# EAGLE design EasyADC (EAGLE 6.1)
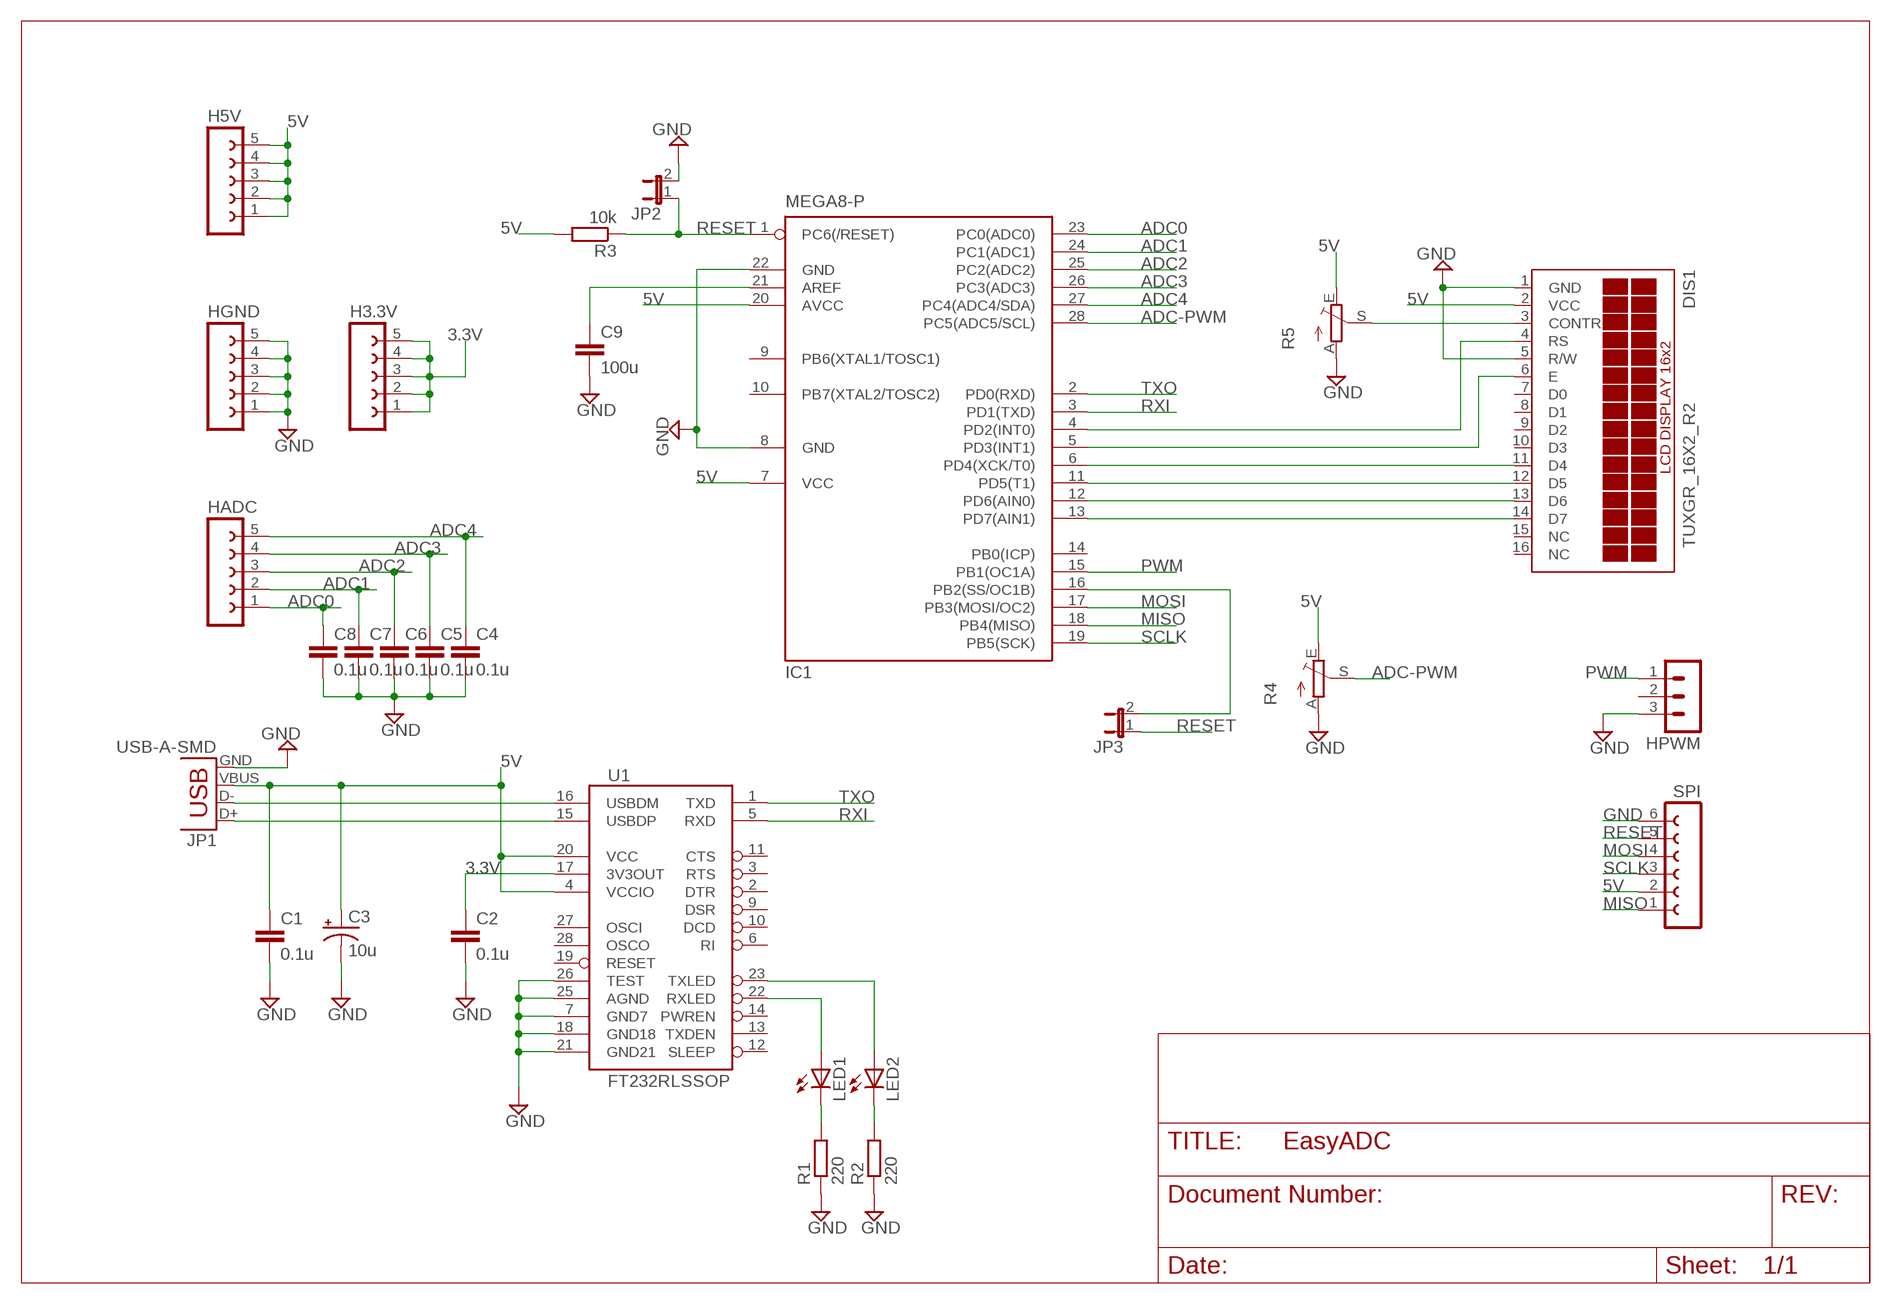
[diagram p0: schematic, sheet 1]

## Parts
C1  0.1u  C-EU050-045X075  [C050-045X075]
C2  0.1u  C-EU050-045X075  [C050-045X075]
C3  10u  CAP_POLPTH2  [CPOL-RADIAL-10UF-25V]
C4  0.1u  C-EU050-045X075  [C050-045X075]
C5  0.1u  C-EU050-045X075  [C050-045X075]
C6  0.1u  C-EU050-045X075  [C050-045X075]
C7  0.1u  C-EU050-045X075  [C050-045X075]
C8  0.1u  C-EU050-045X075  [C050-045X075]
C9  100u  C-EU050-075X075  [C050-075X075]
DIS1  TUXGR_16X2_R2  [TUXGR_16X2_R2]
H3.3V  FE05-1  [FE05-1]
H5V  FE05-1  [FE05-1]
HADC  FE05-1  [FE05-1]
HGND  FE05-1  [FE05-1]
HPWM  MA03-1  [MA03-1]
IC1  MEGA8-P  [DIL28-3]
JP1  USB-A-SMD  [USB-A-S-NOSILK-FEMALE]
JP2  JUMPER-2PTH  [1X02]
JP3  JUMPER-2PTH  [1X02]
LED1  LED3MM  [LED3MM]
LED2  LED3MM  [LED3MM]
R1  220  R-EU_0207/10  [0207/10]
R2  220  R-EU_0207/10  [0207/10]
R3  10k  R-EU_0207/10  [0207/10]
R4  TRIM_EU-CA6H  [CA6H]
R5  TRIM_EU-CA6H  [CA6H]
SPI  FE06-1  [FE06]
U1  FT232RLSSOP  [SSOP28DB]

## Nets
3.3V: C2.1 H3.3V.1 H3.3V.2 H3.3V.3 H3.3V.4 H3.3V.5 U1.17(3V3OUT)
5V: C1.1 C3.1(+) DIS1.2(VCC) H5V.1 H5V.2 H5V.3 H5V.4 H5V.5 IC1.7(VCC) IC1.20(AVCC) JP1.VBUS R3.2 R4.E R5.E SPI.2 U1.4(VCCIO) U1.20(VCC)
ADC0: C8.1 HADC.1 IC1.23(PC0(ADC0))
ADC1: C7.1 HADC.2 IC1.24(PC1(ADC1))
ADC2: C6.1 HADC.3 IC1.25(PC2(ADC2))
ADC3: C5.1 HADC.4 IC1.26(PC3(ADC3))
ADC4: C4.1 HADC.5 IC1.27(PC4(ADC4/SDA))
ADC-PWM: IC1.28(PC5(ADC5/SCL)) R4.S
GND: C1.2 C2.2 C3.2(-) C4.2 C5.2 C6.2 C7.2 C8.2 C9.2 DIS1.1(GND) DIS1.5(R/W) HGND.1 HGND.2 HGND.3 HGND.4 HGND.5 HPWM.3 IC1.8(GND) IC1.22(GND) JP1.GND JP2.2 R1.1 R2.1 R4.A R5.A SPI.6 U1.7(GND7) U1.18(GND18) U1.21(GND21) U1.25(AGND) U1.26(TEST)
MISO: IC1.18(PB4(MISO)) SPI.1
MOSI: IC1.17(PB3(MOSI/OC2)) SPI.4
N$1: LED1.A U1.22(RXLED)
N$2: JP1.D- U1.16(USBDM)
N$3: JP1.D+ U1.15(USBDP)
N$4: LED2.A U1.23(TXLED)
N$5: LED1.K(C) R1.2
N$6: LED2.K(C) R2.2
N$7: DIS1.14(D7) IC1.13(PD7(AIN1))
N$8: DIS1.13(D6) IC1.12(PD6(AIN0))
N$9: DIS1.12(D5) IC1.11(PD5(T1))
N$10: DIS1.11(D4) IC1.6(PD4(XCK/T0))
N$11: DIS1.4(RS) IC1.4(PD2(INT0))
N$12: DIS1.6(E) IC1.5(PD3(INT1))
N$13: DIS1.3(CONTR) R5.S
N$14: C9.1 IC1.21(AREF)
N$15: IC1.16(PB2(SS/OC1B)) JP3.2
PWM: HPWM.1 IC1.15(PB1(OC1A))
RESET: IC1.1(PC6(/RESET)) JP2.1 JP3.1 R3.1 SPI.5
RXI: IC1.3(PD1(TXD)) U1.5(RXD)
SCLK: IC1.19(PB5(SCK)) SPI.3
TXO: IC1.2(PD0(RXD)) U1.1(TXD)
Unconnected: DIS1.7(D0) DIS1.8(D1) DIS1.9(D2) DIS1.10(D3) DIS1.15(NC) DIS1.16(NC) HPWM.2 IC1.9(PB6(XTAL1/TOSC1)) IC1.10(PB7(XTAL2/TOSC2)) IC1.14(PB0(ICP)) U1.2(DTR) U1.3(RTS) U1.6(RI) U1.9(DSR) U1.10(DCD) U1.11(CTS) U1.12(SLEEP) U1.13(TXDEN) U1.14(PWREN) U1.19(RESET) U1.27(OSCI) U1.28(OSCO)

## Library data of the parts
C1 C2 C4-C9 = rcl:C-EU: CAPACITOR, European symbol
C3 = SparkFun-Capacitors:CAP_POL: Capacitor Polarized These are standard SMD and PTH capacitors. Normally 10uF, 47uF, and 100uF in electrolytic and tantalum varieties. Always verify the external diameter of the through hole cap, it varies with capacity, voltage, and manufacturer. The EIA devices should be standard.
DIS1 = display-lcd:TUXGR_16X2_R2: Tuxgraphics LCD display 16x2 characters reflective, without background light Source: tuxgr_12x2_r2.pdf; OC_FARNELL: unknown; OC_NEWARK: unknown
H3.3V H5V HADC HGND = con-lsta:FE05-1: FEMALE HEADER; OC_FARNELL: unknown; OC_NEWARK: unknown
HPWM = con-lstb:MA03-1: PIN HEADER; OC_FARNELL: unknown; OC_NEWARK: unknown
IC1 = atmel:MEGA8-P: MICROCONTROLLER 8 Kbytes FLASH, 1 kbytes SRAM, 512 bytes EEPROM, USART, 4-channel 10 bit ADC, 2-channel 8 bit ADC Pin compatible with Atmega48, ATMega88, ATMega168 Source: avr.lbr; OC_FARNELL: unknown; OC_NEWARK: unknown
JP1 = SparkFun-Connectors:USB: USB Connectors USB-B-PTH is fully proven SKU : PRT-00139/CONN-08278 USB-miniB is fully proven SKU : PRT-00587 USB-A-PCB is untested. USB-A-H is throughly reviewed, but untested. Spark Fun Electronics SKU : PRT-00437 USB-B-SMT is throughly reviewed, but untested. Needs silkscreen touching up. USB-A-S has not been used/tested USB-MB-H has not been used/tested USB-MICROB has been used. CONN-09505; PROD_ID: CONN-09520
JP2 JP3 = SparkFun-Retired:JUMPER-2: Jumper Basic 0.1" spaced jumper. Use with breakaway headers.
LED1 LED2 = led:LED: LED OSRAM: - CHIPLED LG R971, LG N971, LY N971, LG Q971, LY Q971, LO R971, LY R971 LH N974, LH R974 LS Q976, LO Q976, LY Q976 LO Q996 - Hyper CHIPLED LW Q18S LB Q993, LB Q99A, LB R99A - SideLED LS A670, LO A670, LY A670, LG A670, LP A670 LB A673, LV A673, LT A673, LW A673 LH A674 LY A675 LS A676, LA A676, LO A676, LY A676, LW A676 LS A679, LY A679, LG A679 - Hyper Micro SIDELED® LS Y876, LA Y876, LO Y876, LY Y876 LT Y87S - SmartLED LW L88C, LW L88S LB L89C, LB L89S, LG L890 LS L89K, LO L89K, LY L89K LS L896, LA L896, LO L896, LY L896 - TOPLED LS T670, LO T670, LY T670, LG T670, LP T670 LSG T670, LSP T670, LSY T670, LOP T670, LYG T670 LG T671, LOG T671, LSG T671 LB T673, LV T673, LT T673, LW T673 LH T674 LS T676, LA T676, LO T676, LY T676, LB T676, LH T676, LSB T676, LW T676 LB T67C, LV T67C, LT T67C, LS T67K, LO T67K, LY T67K, LW E67C LS E67B, LA E67B, LO E67B, LY E67B, LB E67C, LV E67C, LT E67C LW T67C LS T679, LY T679, LG T679 LS T770, LO T770, LY T770, LG T770, LP T770 LB T773, LV T773, LT T773, LW T773 LH T774 LS E675, LA E675, LY E675, LS T675 LS T776, LA T776, LO T776, LY T776, LB T776 LHGB T686 LT T68C, LB T68C - Hyper Mini TOPLED® LB M676 - Mini TOPLED Santana® LG M470 LS M47K, LO M47K, LY M47K Source: http://www.osram.convergy.de LUXEON: - LUMILED® LXK2-PW12-R00, LXK2-PW12-S00, LXK2-PW14-U00, LXK2-PW14-V00 LXK2-PM12-R00, LXK2-PM12-S00, LXK2-PM14-U00 LXK2-PE12-Q00, LXK2-PE12-R00, LXK2-PE12-S00, LXK2-PE14-T00, LXK2-PE14-U00 LXK2-PB12-K00, LXK2-PB12-L00, LXK2-PB12-M00, LXK2-PB14-N00, LXK2-PB14-P00, LXK2-PB14-Q00 LXK2-PR12-L00, LXK2-PR12-M00, LXK2-PR14-Q00, LXK2-PR14-R00 LXK2-PD12-Q00, LXK2-PD12-R00, LXK2-PD12-S00 LXK2-PH12-R00, LXK2-PH12-S00 LXK2-PL12-P00, LXK2-PL12-Q00, LXK2-PL12-R00 Source: www.luxeon.com KINGBRIGHT: KA-3528ASYC Source: www.kingbright.com
R1-R3 = rcl:R-EU_: RESISTOR, European symbol
R4 R5 = pot:TRIM_EU-: POTENTIOMETER
SPI = con-lsta:FE06-1: FEMALE HEADER; OC_FARNELL: unknown; OC_NEWARK: unknown
U1 = SparkFun-DigitalIC:FT232RL: USB UART FT232RL 4th Generation USB UART (USB <-> Serial) Controller. Spark Fun Electronics SKU : COM-00650 Production SKU IC-00870; PROD_ID: IC-00870

## Board
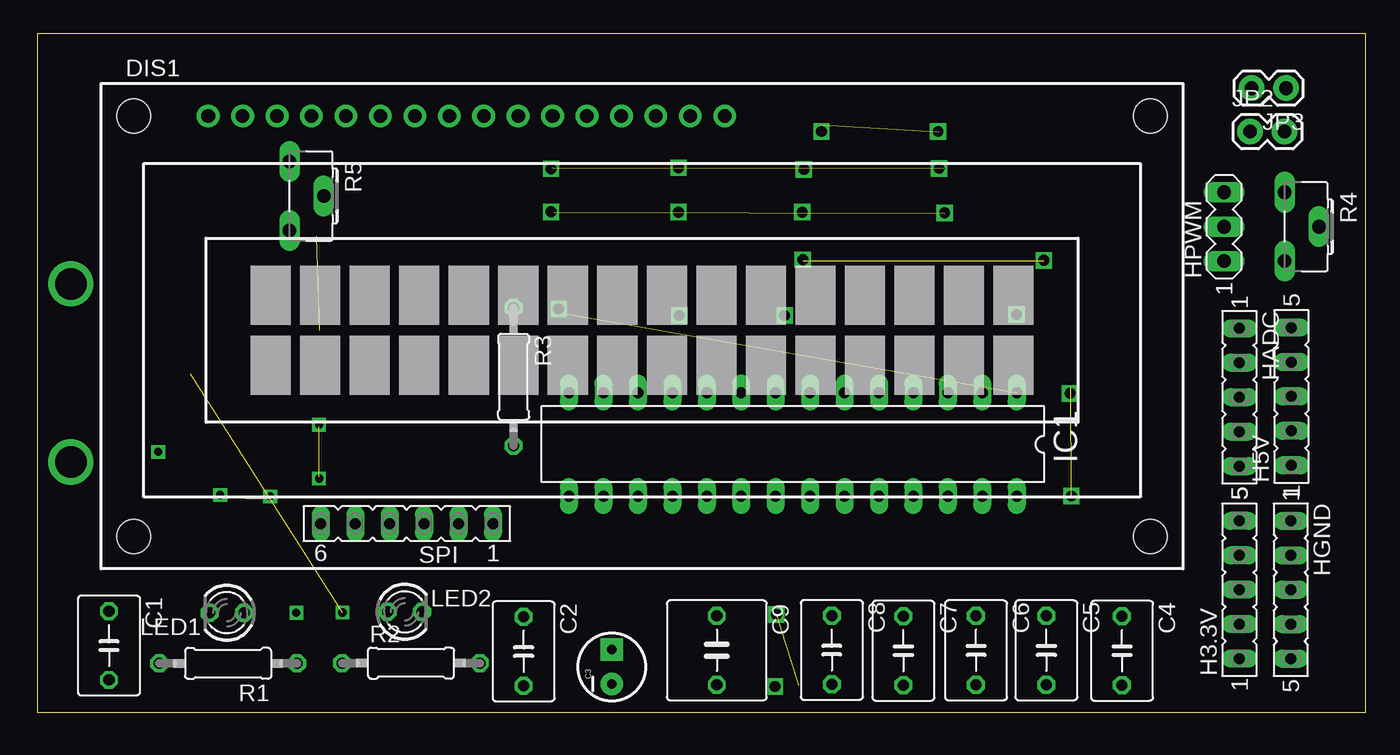
[diagram p1: board, top side]
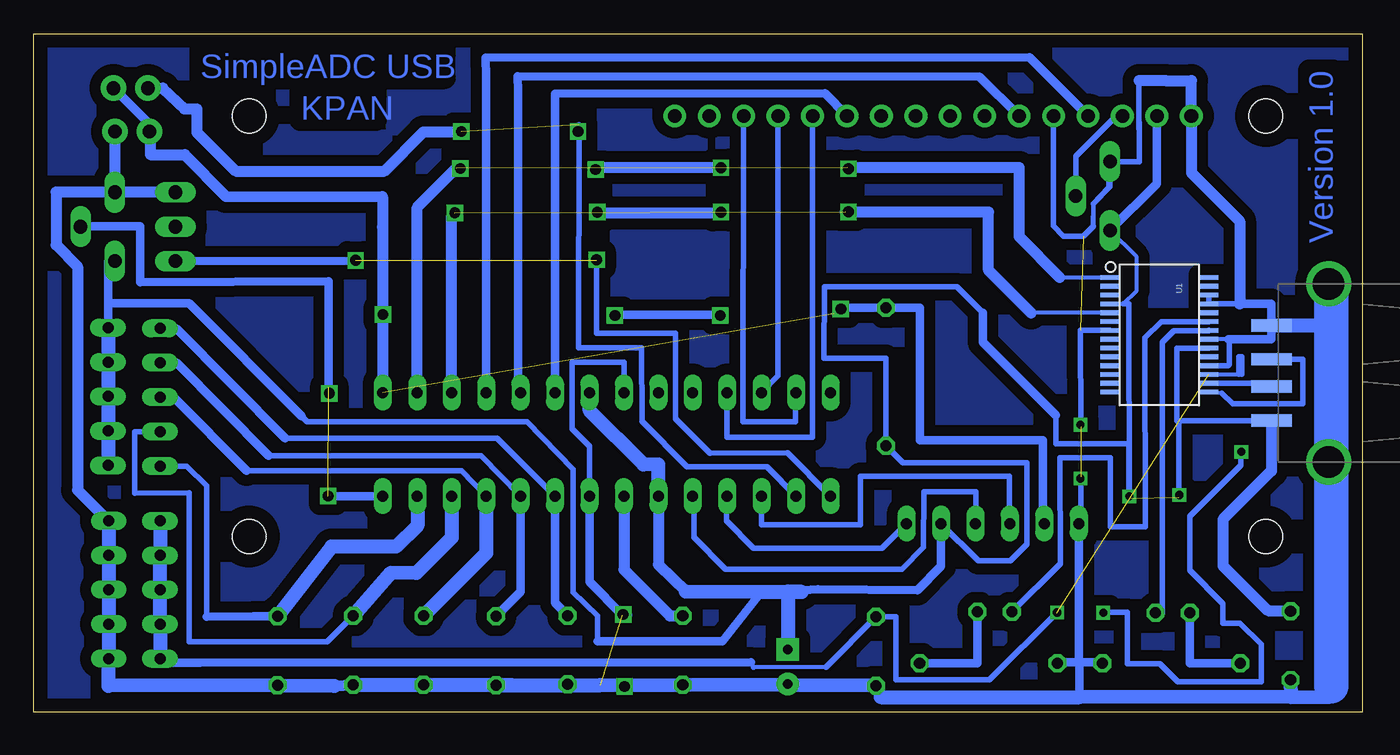
[diagram p2: board, bottom side, seen from below]

Size 98 x 50 mm. Coordinates in mm from the lower left corner, seen from the top.
Outline: 0,0 98,0 98,50 0,50 0,0
Copper layers (1*16): Top 0.035mm / dielectric 1.5mm / Bottom 0.035mm
Design rules: minimum track width 10mil, minimum drill 24mil, track to track 8mil, track to pad 8mil, pad to pad 8mil, via to via 8mil, smd to smd 8mil, copper to edge 40mil, drill to drill 8mil, minimum pad ring 10mil, minimum via ring 8mil, stop-mask expansion 4mil, vias tented up to drill 0mil, thermal gap 10mil

### Footprints (pad centres in the part's own frame; a part is rotated, then mirrored left to right if it is on the bottom)
C050-045X075 = drill 0.813 octagon: 1 -2.54,0; 2 2.54,0
CPOL-RADIAL-10UF-25V = drill 0.7 pad 1.651 square: 1 1.27,0 | drill 0.7 pad 1.651: 2 -1.27,0
C050-075X075 = drill 0.813 octagon: 1 -2.54,0; 2 2.54,0
TUXGR_16X2_R2 = drill 1 pad 1.676: 1 -32,15.5; 2 -29.46,15.5; 3 -26.92,15.5; 4 -24.38,15.5; 5 -21.84,15.5; 6 -19.3,15.5; 7 -16.76,15.5; 8 -14.22,15.5; 9 -11.68,15.5; 10 -9.14,15.5; 11 -6.6,15.5; 12 -4.06,15.5; 13 -1.52,15.5; 14 1.02,15.5; 15 3.56,15.5; 16 6.1,15.5 | hole 2.5: -37.5,-15.5; 37.5,-15.5; -37.5,15.5; 37.5,15.5
FE05-1 = drill 0.813 long: 1 -5.08,0; 2 -2.54,0; 3 0,0; 4 2.54,0; 5 5.08,0
MA03-1 = drill 1.016 long: 1 -2.54,0; 2 0,0; 3 2.54,0
DIL28-3 = drill 0.813 long: 1 -16.51,-3.81; 2 -13.97,-3.81; 3 -11.43,-3.81; 4 -8.89,-3.81; 5 -6.35,-3.81; 6 -3.81,-3.81; 7 -1.27,-3.81; 8 1.27,-3.81; 9 3.81,-3.81; 10 6.35,-3.81; 11 8.89,-3.81; 12 11.43,-3.81; 13 13.97,-3.81; 14 16.51,-3.81; 15 16.51,3.81; 16 13.97,3.81; 17 11.43,3.81; 18 8.89,3.81; 19 6.35,3.81; 20 3.81,3.81; 21 1.27,3.81; 22 -1.27,3.81; 23 -3.81,3.81; 24 -6.35,3.81; 25 -8.89,3.81; 26 -11.43,3.81; 27 -13.97,3.81; 28 -16.51,3.81
USB-A-S-NOSILK-FEMALE = smd 3 x 0.9: D+ 4.212,-1; D- 4.212,1; GND 4.212,-3.5; VBUS 4.212,3.5 | drill 2.311: S1 0,-6.566; S2 0,6.566
1X02 = drill 1.016 pad 1.88: 1 0,0; 2 2.54,0
LED3MM = drill 0.813 octagon: A -1.27,0; K 1.27,0
0207/10 = drill 0.813 octagon: 1 -5.08,0; 2 5.08,0
CA6H = drill 1.016 long: A -2.54,0; E 2.54,0; S 0,2.54
FE06 = drill 0.813 long: 1 -6.35,0; 2 -3.81,0; 3 -1.27,0; 4 1.27,0; 5 3.81,0; 6 6.35,0
SSOP28DB = smd 0.348 x 1.397: 1 -4.225,-3.656; 2 -3.575,-3.656; 3 -2.925,-3.656; 4 -2.275,-3.656; 5 -1.625,-3.656; 6 -0.975,-3.656; 7 -0.325,-3.656; 8 0.325,-3.656; 9 0.975,-3.656; 10 1.625,-3.656; 11 2.275,-3.656; 12 2.925,-3.656; 13 3.575,-3.656; 14 4.225,-3.656; 15 4.225,3.656; 16 3.575,3.656; 17 2.925,3.656; 18 2.275,3.656; 19 1.625,3.656; 20 0.975,3.656; 21 0.325,3.656; 22 -0.325,3.656; 23 -0.975,3.656; 24 -1.625,3.656; 25 -2.275,3.656; 26 -2.925,3.656; 27 -3.575,3.656; 28 -4.225,3.656

### Placement (x,y rotation side)
C1  5.31,4.9 270 top
C2  35.89,4.47 270 top
C3  42.39,3.33 90 top
C4  80.04,4.52 270 top
C5  74.45,4.55 270 top
C6  69.27,4.55 270 top
C7  63.91,4.52 270 top
C8  58.62,4.57 270 top
C9  50.14,4.55 270 top
DIS1  44.63,28.45 0 top
H3.3V  88.7,9.02 90 top
H5V  92.53,23.27 90 top
HADC  88.7,23.22 270 top
HGND  92.48,9.02 270 top
HPWM  87.55,35.79 90 top
IC1  55.75,19.74 180 top
JP1  2.5,25 180 bottom
JP2  89.48,42.8 0 top
JP3  92.13,46 180 top
LED1  14,7.32 180 top
LED2  27.13,7.39 0 top
R1  14.1,3.58 180 top
R2  27.58,3.61 0 top
R3  35.15,24.71 270 top
R4  92.02,35.79 270 top
R5  18.62,38.05 270 top
SPI  27.28,13.89 180 top
U1  14.99,27.81 270 bottom

### Tracks (layer width: path | path; a pad name or v marks a point on that pad's centre or on a via)
3.3V  (1 unrouted)
  Bottom 0.305: 39.57,3.3 44.93,3.3
  Bottom 0.406: 44.93,3.3 45.11,3.66 | 39.57,3.3 C2.1 34.42,7.01 34.42,2.36 27.51,2.36 22.56,7.32
  Bottom 0.61: 45.11,3.66 85.73,3.63 88.65,3.63 H3.3V.1
  Bottom 1.016: H3.3V.5 H3.3V.4 H3.3V.3 H3.3V.2 H3.3V.1
5V  (1 unrouted)
  Bottom 0.305: U1.4 17.64,30.09 16.66,31.06 16.66,33.55 R5.E
  Bottom 0.406: SPI.2 28.35,11.15 25.96,11.15 24.74,12.37 24.74,18.36 33.88,18.36 R3.2 35.15,26.09 39.73,26.09 39.67,31.37 29.92,31.37 29.16,30.58 28.02,29.44 | U1.20 13.69,26.84 13.69,21.46 13.56,21.46 | 13.56,21.46 6.71,21.46 JP1.VBUS | 17.64,30.09 17.25,30.09 17.2,15.72 17.22,15.72 17.22,19.79 22.63,19.79 22.63,21.89 | 13.56,21.46 13.56,15.8 | H5V.3 92.51,23.27 92.51,30.12 | 78.26,21.82 77.85,21.39 61.62,21.39 58.24,17.91 58.24,8.84 56.44,7.09 56.44,5.23
  Bottom 0.61: SPI.2 31.09,10.74 32.84,8.99 40.16,9.04 42.39,8.89 | R4.E 92.53,33.25 H5V.5 | DIS1.2 15.17,38.96 R5.E | 92.51,30.12 86.56,30.12 78.26,21.82 | 56.44,5.23 47.22,5.23 44.32,8.87 | 22.63,21.89 27.99,27.28 28.02,29.44
  Bottom 0.813: IC1.20 51.94,10.87 49.91,8.89 | JP1.VBUS 6.71,17.77 10.29,14.2 10.29,10.77 6.99,7.47 5.33,7.47 C1.1
  Bottom 1.016: H5V.5 H5V.4 H5V.3 H5V.2 H5V.1 | IC1.20 51.94,18.24 53.04,18.26 57,22.23 IC1.7 | 49.91,8.89 44.32,8.87 41.35,8.87 42.39,8.89 C3.1
ADC0
  Bottom 0.406: HADC.1 87.45,28.25 | 79.45,20.19 63.83,20.19 IC1.23
  Bottom 0.61: 87.45,28.25 79.45,20.19 | IC1.23 59.56,8.05 C8.1
ADC1
  Bottom 0.406: IC1.24 65,18.9 80.7,18.9 | 87.48,25.76 HADC.2
  Bottom 0.61: 80.7,18.9 87.48,25.76 | IC1.24 62.1,8.87 C7.1
ADC2
  Bottom 0.406: HADC.3 87.71,23.22 | 82.3,17.78 66.45,17.78 IC1.25
  Bottom 0.61: 87.71,23.22 82.3,17.78
  Bottom 1.016: IC1.25 64.64,11.71 C6.1
ADC3
  Bottom 0.406: HADC.4 90.58,20.68 90.58,16.13 86.54,16.18 86.54,5.18 76.35,5.18 C5.1
  Bottom 1.016: IC1.26 67.18,12.85 69.8,10.24 71.68,10.26 C5.1
ADC4
  Bottom 0.406: HADC.5 86.72,18.14 85.24,16.69 85.27,7.01
  Bottom 0.61: 85.27,7.01 81.79,7.06 C4.1
  Bottom 1.016: IC1.27 69.7,13.74 71.3,12.19 76.05,12.19 C4.1
ADC-PWM  (via drill 0.8)  (1 unrouted)
  Bottom 0.406: R4.S 94.54,35.79
  Bottom 0.61: 76.25,23.95 76.25,31.75 90.14,31.67 90.14,35.81 94.56,35.81 R4.S | IC1.28 v76.3,15.93
GND  (3 unrouted)
  Bottom 0.305: U1.21 9.88,27.49 | 19.86,35.81 19.86,37.49 19.89,35.79
  Bottom 0.406: IC1.8 54.46,25.78 58.32,25.78 58.32,20.9 57.02,19.61 IC1.22 | 22.63,3.66 R2.1 | U1.26 U1.25 9.07,30.09 | 19.86,35.81 19.89,35.79 20.6,35.08 22.05,35.08 22.81,35.84 22.81,43.93 DIS1.5 | U1.18 9.92,25.54 9.83,25.63 9.83,27.44 9.88,27.49 | 12.62,46.56 12.62,43.97 | SPI.6 20.78,13.89 20.78,17.35 | U1.7 20.83,28.14 20.78,21.03 | 16.48,46.56 16.46,40.59 R5.A 18.62,38.73 19.86,37.49 18.69,38.71 18.69,40.56 16.46,40.62 16.48,45.21 16.48,46.56
  Bottom 0.61: IC1.22 57.02,9.6 54.58,7.14 | 9.88,27.49 6.71,27.49 JP1.GND 6.71,30.09 9.07,30.09 | 20.88,3.66 22.63,3.66 | 20.88,1.12 20.88,3.66 | 20.88,3.66 19.08,3.66 R1.1 | SPI.6 20.93,3.58 20.88,3.66 | 12.63,46.56 14.53,46.56
  Bottom 0.813: 75.82,1.93 C5.2 | 62.79,2.01 C7.2 | 56.21,1.98 C8.2 | 54.58,7.14 54.28,7.14 | 35.53,1.09 35.61,1.32 C2.2 41.35,1.93 C3.2 | HPWM.3 R4.A | JP2.2 R4.A | R4.A 96.37,38.33 96.37,34.44 94.77,32.84 94.77,16.36 92.48,14.07 | DIS1.1 12.63,46.56 | 16.48,46.56 14.53,46.56 12.62,46.56 | 12.62,43.97 12.62,39.75 9.07,36.2 9.07,30.09
  Bottom 1.016: 75.82,1.93 C4.2 92.48,1.93 HGND.5 HGND.4 HGND.3 HGND.2 92.48,14.07 HGND.1 | C5.2 C6.2 62.79,2.01 | C7.2 56.21,1.98 C9.2 C2.2 | 35.53,1.09 20.88,1.09 20.88,1.12 5.28,1.09 | C1.2 5.28,1.09 | 5.28,1.09 2.51,1.12 | JP1.GND 2.51,28.5 arc-90 2.49,28.52
MISO
  Bottom 0.406: SPI.1 35.43,12.09 44.91,12.09 46.91,14.1 IC1.18
MOSI
  Bottom 0.406: SPI.4 26.06,15.19 26.04,17.37 37.03,17.37 37.03,13.82 44.32,13.82 IC1.17
N$1
  Bottom 0.406: LED1.A 14.76,7.29 14.76,27.28 13.92,28.12 11.35,28.12 U1.22
N$2
  Bottom 0.305: 7.37,24.02 7.59,24.24
  Bottom 0.406: JP1.D- 7.37,24.02 7.37,24.03 | 7.59,24.24 U1.16
N$3
  Bottom 0.305: 10.39,23.52 U1.15
  Bottom 0.406: JP1.D+ 4.42,26 4.42,22.73 9.58,22.73 10.39,23.52
N$4
  Bottom 0.406: U1.23 14.85,28.79 16.05,27.58 16.03,13.66 18.59,13.66 18.59,18.75 22.33,18.75 22.3,10.95 LED2.A
N$5
  Bottom 0.61: LED1.K 12.73,3.58 R1.2
N$6
  Bottom 0.61: LED2.K 28.4,3.61 R2.2
N$7
  Bottom 0.406: DIS1.14 45.7,21.39 41.83,21.39 IC1.13
N$8
  Bottom 0.406: DIS1.13 43.11,24.79 IC1.12
N$9
  Bottom 0.406: DIS1.12 40.57,20.24 46.89,20.24 46.89,23.55 IC1.11
N$10
  Bottom 0.61: DIS1.11 39.65,45.62 59.56,45.59 IC1.6
N$11
  Bottom 0.61: DIS1.4 24.56,48.28 64.67,48.26 64.64,46.84 IC1.4
N$12
  Bottom 0.406: 62.1,23.98 IC1.5
  Bottom 0.61: DIS1.6 28.27,46.84 62.31,46.86 62.28,45.77 62.28,24.16
  Bottom 0.813: 62.28,24.16 62.1,23.98
N$13
  Bottom 0.406: DIS1.3 18.16,43.95 21.13,40.97 21.13,38.08 R5.S
N$14
  Bottom 0.813: IC1.21 54.48,10.49 51.08,7.09 C9.1
N$15  (1 unrouted)
  Bottom 0.406: IC1.16 43.94,18.09 49.81,18.09 53.16,21.44 53.19,26.85 57.81,26.85 57.79,43.31
  Bottom 0.813: JP3.2 88.49,46 86.89,44.48 85.98,44.48 85.98,42.75 83.11,39.88 72.14,39.88 69.27,42.77 66.47,42.77
N$16
  Bottom 2.54: 2.59,31.55 2.31,31.27 2.31,1.91
N$17  (via drill 0.8)
  other vias: 54.43,1.88
N$18  (via drill 0.8)
  other vias: 54.53,7.19
N$19  (via drill 0.8)
  other vias: 76.2,23.5
N$20  (via drill 0.8)
  other vias: 56.49,33.35
N$21  (via drill 0.8)
  other vias: 57.86,42.8
N$22  (via drill 0.8)
  other vias: 66.47,42.8
N$23  (via drill 0.8)
  other vias: 74.27,33.3
N$24  (via drill 0.8)
  other vias: 37.92,40.06
N$25  (via drill 0.8)
  other vias: 37.92,36.88
N$26  (via drill 0.8)
  other vias: 38.48,29.72
N$27  (via drill 0.8)
  other vias: 66.55,40.08
N$28  (via drill 0.8)
  other vias: 66.95,36.8
N$29  (via drill 0.8)
  other vias: 47.32,36.86
N$30  (via drill 0.8)
  other vias: 56.44,36.86
N$31  (via drill 0.8)
  other vias: 56.57,40.01
N$32  (via drill 0.8)
  Bottom 0.305: 56.46,40.13 56.64,39.95
  Bottom 0.813: v47.32,40.13 56.46,40.13
N$33
  Bottom 0.813: 47.32,36.78 56.57,36.78
N$34  (via drill 0.8)
  other vias: 47.37,29.24
N$35  (via drill 0.8)
  other vias: 55.14,29.24
N$36  (via drill 0.8)
  other vias: 72.26,29.31
N$37
  Bottom 0.61: 47.37,29.29 55.09,29.29 55.25,29.13
N$38  (via drill 0.6)
  other vias: 20.8,17.22
N$39  (via drill 0.6)
  other vias: 20.8,21.18
N$40  (via drill 0.6)
  other vias: 17.2,15.9
N$41  (via drill 0.6)
  other vias: 13.51,16
N$42  (via drill 0.6)
  other vias: 22.53,7.34
N$43  (via drill 0.6)
  other vias: 19.13,7.32
N$44  (via drill 0.6)
  other vias: 8.94,19.18
N$45
  Bottom 0.406: 19,7.37 17.35,7.37 17.35,3.56 14.96,3.56 13.64,2.23 7.47,2.23 7.47,5 9.04,6.55 10.31,6.55 10.31,8 12.75,10.44 12.75,14.43 8.99,18.19 8.97,19.18
N$46
  pour Bottom (isolate 0.813): 0,50.01 0,0 97.99,0 97.99,50.01
N$47
  Bottom 0.305: 11.28,24.87 11.28,24.89 9.12,24.89 8.89,24.89
  Bottom 0.406: 8.89,24.89 8.89,26.21 9.12,26.21 9.12,24.89
PWM  (1 unrouted)
  Bottom 0.406: IC1.15 42.42,19.1 48.13,19.07 50.67,21.61 50.67,27.94 56.52,27.94 56.52,33.27
  Bottom 0.61: HPWM.1 74.27,33.27
RESET  (1 unrouted)
  Bottom 0.305: 38.99,29.36 38.86,29.45 | 38.86,29.45 38.86,29.74 | 37.89,29.79 38.86,29.45
  Bottom 0.61: SPI.5 23.5,13.92 23.57,13.92 23.57,20.04 32.64,20.04 32.64,29.79 R3.1 37.89,29.79 | JP3.1 89.48,43.36 JP2.1 89.41,42.8 | 72.29,35.76 72.26,35.76
  Bottom 0.813: 89.41,42.8 89.41,41.1 86.87,41.1 83.85,38.02 72.29,38 72.29,35.76 | 72.26,35.76 IC1.1
RXI  (1 unrouted)
  Bottom 0.305: 67.18,36.58 66.98,36.78 | U1.5 24.46,29.44
  Bottom 0.813: IC1.3 67.18,36.58 | 24.46,29.44 27.58,32.56 27.58,36.85 38.15,36.85
SCLK
  Bottom 0.406: IC1.19 49.4,16.84 arc-90 49.33,16.03 49.33,12.88 46.99,10.54 33.99,10.54 32.39,12.14 32.36,16.26 28.5,16.26 SPI.3
TXO  (1 unrouted)
  Bottom 0.305: U1.1 22.34,32.04
  Bottom 0.813: IC1.2 69.72,37.21 66.85,40.08 | 22.34,32.04 25.32,35.05 25.32,40.13 38,40.13

### Text on the board
Bottom: Version 1.0 | SimpleADC USB | KPAN